# EAGLE schematic taillights3 (EAGLE 8.3.2)
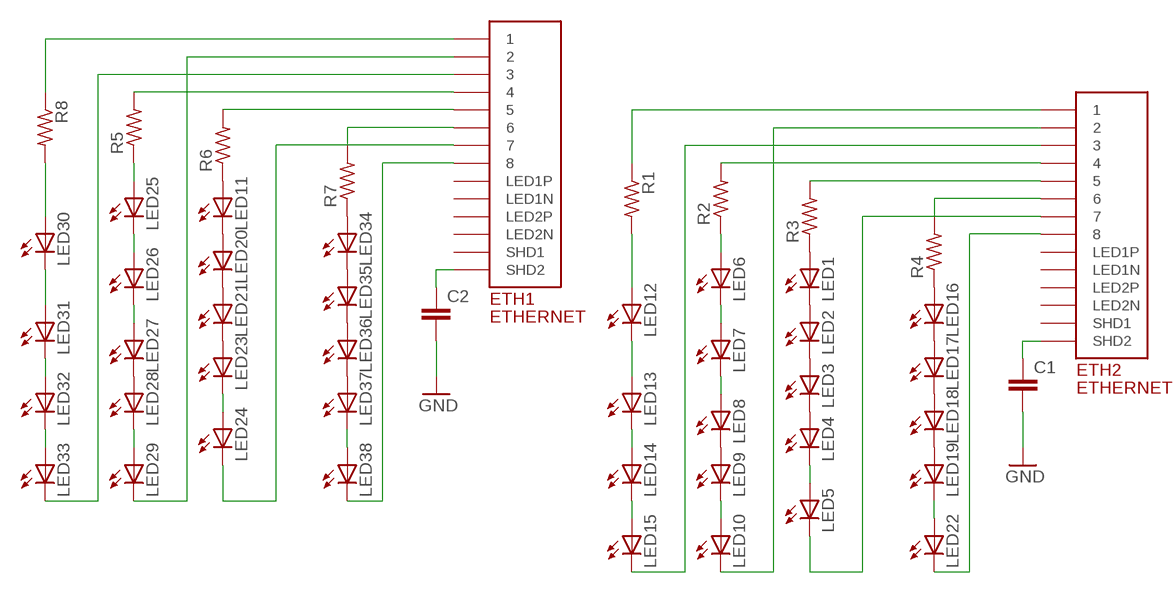
[diagram p0: schematic, sheet 1]

## Parts
C1  C2,5-3  [C2.5-3]
C2  C2,5-3  [C2.5-3]
ETH1  ETHERNET  [A122645-ND]
ETH2  ETHERNET  [A122645-ND]
LED1  LED  [SMARTLED-TTW]
LED2  LED  [SMARTLED-TTW]
LED3  LED  [SMARTLED-TTW]
LED4  LED  [SMARTLED-TTW]
LED5  LED  [SMARTLED-TTW]
LED6  LED  [SMARTLED-TTW]
LED7  LED  [SMARTLED-TTW]
LED8  LED  [SMARTLED-TTW]
LED9  LED  [SMARTLED-TTW]
LED10  LED  [SMARTLED-TTW]
LED11  LED  [SMARTLED-TTW]
LED12  LED  [SMARTLED-TTW]
LED13  LED  [SMARTLED-TTW]
LED14  LED  [SMARTLED-TTW]
LED15  LED  [SMARTLED-TTW]
LED16  LED  [SMARTLED-TTW]
LED17  LED  [SMARTLED-TTW]
LED18  LED  [SMARTLED-TTW]
LED19  LED  [SMARTLED-TTW]
LED20  LED  [SMARTLED-TTW]
LED21  LED  [SMARTLED-TTW]
LED22  LED  [SMARTLED-TTW]
LED23  LED  [SMARTLED-TTW]
LED24  LED  [SMARTLED-TTW]
LED25  LED  [SMARTLED-TTW]
LED26  LED  [SMARTLED-TTW]
LED27  LED  [SMARTLED-TTW]
LED28  LED  [SMARTLED-TTW]
LED29  LED  [SMARTLED-TTW]
LED30  LED  [SMARTLED-TTW]
LED31  LED  [SMARTLED-TTW]
LED32  LED  [SMARTLED-TTW]
LED33  LED  [SMARTLED-TTW]
LED34  LED  [SMARTLED-TTW]
LED35  LED  [SMARTLED-TTW]
LED36  LED  [SMARTLED-TTW]
LED37  LED  [SMARTLED-TTW]
LED38  LED  [SMARTLED-TTW]
R1  R-US_0204/5  [0204/5]
R2  R-US_0204/2V  [0204V]
R3  R-US_0204/2V  [0204V]
R4  R-US_0204/2V  [0204V]
R5  R-US_0204/2V  [0204V]
R6  R-US_0204/2V  [0204V]
R7  R-US_0204/2V  [0204V]
R8  R-US_0204/5  [0204/5]

## Nets
GND: C1.2 C2.2
N$1: LED1.A@1(A) R3.1
N$2: LED6.A@1(A) R2.1
N$3: LED12.A@1(A) R1.2
N$4: LED1.C@1(C) LED2.A@1(A)
N$5: LED2.C@1(C) LED3.A@1(A)
N$6: LED3.C@1(C) LED4.A@1(A)
N$7: LED4.C@1(C) LED5.A@1(A)
N$8: LED6.C@1(C) LED7.A@1(A)
N$9: LED7.C@1(C) LED8.A@1(A)
N$10: LED8.C@1(C) LED9.A@1(A)
N$11: LED9.C@1(C) LED10.A@1(A)
N$12: ETH2.P$2 LED10.C@1(C)
N$13: LED12.C@1(C) LED13.A@1(A)
N$14: LED13.C@1(C) LED14.A@1(A)
N$15: LED14.C@1(C) LED15.A@1(A)
N$16: LED16.C@1(C) LED17.A@1(A)
N$17: LED17.C@1(C) LED18.A@1(A)
N$18: LED18.C@1(C) LED19.A@1(A)
N$19: LED16.A@1(A) R4.1
N$20: C1.1 ETH2.P$14(SHD2)
N$21: ETH2.P$5 R3.2
N$22: ETH2.P$6 R4.2
N$23: LED19.C@1(C) LED22.A@1(A)
N$24: ETH2.P$4 R2.2
N$25: ETH2.P$3 LED15.C@1(C)
N$26: ETH2.P$1 R1.1
N$27: ETH2.P$7 LED5.C@1(C)
N$28: ETH2.P$8 LED22.C@1(C)
N$29: LED11.C@1(C) LED20.A@1(A)
N$30: LED20.C@1(C) LED21.A@1(A)
N$31: LED21.C@1(C) LED23.A@1(A)
N$32: LED23.C@1(C) LED24.A@1(A)
N$33: LED25.C@1(C) LED26.A@1(A)
N$34: LED26.C@1(C) LED27.A@1(A)
N$35: LED27.C@1(C) LED28.A@1(A)
N$36: LED28.C@1(C) LED29.A@1(A)
N$37: LED30.C@1(C) LED31.A@1(A)
N$38: LED31.C@1(C) LED32.A@1(A)
N$39: LED32.C@1(C) LED33.A@1(A)
N$40: LED34.C@1(C) LED35.A@1(A)
N$41: LED35.C@1(C) LED36.A@1(A)
N$42: LED36.C@1(C) LED37.A@1(A)
N$43: LED30.A@1(A) R8.2
N$44: LED34.A@1(A) R7.1
N$45: C2.1 ETH1.P$14(SHD2)
N$46: LED11.A@1(A) R6.1
N$47: LED25.A@1(A) R5.1
N$48: LED37.C@1(C) LED38.A@1(A)
N$49: ETH1.P$5 R6.2
N$50: ETH1.P$6 R7.2
N$51: ETH1.P$4 R5.2
N$52: ETH1.P$3 LED33.C@1(C)
N$53: ETH1.P$2 LED29.C@1(C)
N$54: ETH1.P$1 R8.1
N$55: ETH1.P$7 LED24.C@1(C)
N$56: ETH1.P$8 LED38.C@1(C)
Unconnected: ETH1.P$9(LED1N) ETH1.P$10(LED1P) ETH1.P$11(LED2N) ETH1.P$12(LED2P) ETH1.P$13(SHD1) ETH2.P$9(LED1N) ETH2.P$10(LED1P) ETH2.P$11(LED2N) ETH2.P$12(LED2P) ETH2.P$13(SHD1)

## Library data of the parts
C1 C2 = capacitor-wima:C: CAPACITOR naming: grid - package width
ETH1 ETH2 = ETHERNET:ETHERNET: Ethernet port with 2 leds. digikey number A122645-ND
LED1-LED38 = E-P-008-R1.2:LED: LED OSRAM: - CHIPLED LG R971, LG N971, LY N971, LG Q971, LY Q971, LO R971, LY R971 LH N974, LH R974 LS Q976, LO Q976, LY Q976 LO Q996 - Hyper CHIPLED LW Q18S LB Q993, LB Q99A, LB R99A - SideLED LS A670, LO A670, LY A670, LG A670, LP A670 LB A673, LV A673, LT A673, LW A673 LH A674 LY A675 LS A676, LA A676, LO A676, LY A676, LW A676 LS A679, LY A679, LG A679 - Hyper Micro SIDELED® LS Y876, LA Y876, LO Y876, LY Y876 LT Y87S - SmartLED LW L88C, LW L88S LB L89C, LB L89S, LG L890 LS L89K, LO L89K, LY L89K LS L896, LA L896, LO L896, LY L896 - TOPLED LS T670, LO T670, LY T670, LG T670, LP T670 LSG T670, LSP T670, LSY T670, LOP T670, LYG T670 LG T671, LOG T671, LSG T671 LB T673, LV T673, LT T673, LW T673 LH T674 LS T676, LA T676, LO T676, LY T676, LB T676, LH T676, LSB T676, LW T676 LB T67C, LV T67C, LT T67C, LS T67K, LO T67K, LY T67K, LW E67C LS E67B, LA E67B, LO E67B, LY E67B, LB E67C, LV E67C, LT E67C LW T67C LS T679, LY T679, LG T679 LS T770, LO T770, LY T770, LG T770, LP T770 LB T773, LV T773, LT T773, LW T773 LH T774 LS E675, LA E675, LY E675, LS T675 LS T776, LA T776, LO T776, LY T776, LB T776 LHGB T686 LT T68C, LB T68C - Hyper Mini TOPLED® LB M676 - Mini TOPLED Santana® LG M470 LS M47K, LO M47K, LY M47K Source: http://www.osram.convergy.de LUXEON: - LUMILED® LXK2-PW12-R00, LXK2-PW12-S00, LXK2-PW14-U00, LXK2-PW14-V00 LXK2-PM12-R00, LXK2-PM12-S00, LXK2-PM14-U00 LXK2-PE12-Q00, LXK2-PE12-R00, LXK2-PE12-S00, LXK2-PE14-T00, LXK2-PE14-U00 LXK2-PB12-K00, LXK2-PB12-L00, LXK2-PB12-M00, LXK2-PB14-N00, LXK2-PB14-P00, LXK2-PB14-Q00 LXK2-PR12-L00, LXK2-PR12-M00, LXK2-PR14-Q00, LXK2-PR14-R00 LXK2-PD12-Q00, LXK2-PD12-R00, LXK2-PD12-S00 LXK2-PH12-R00, LXK2-PH12-S00 LXK2-PL12-P00, LXK2-PL12-Q00, LXK2-PL12-R00 Source: www.luxeon.com KINGBRIGHT: KA-3528ASYC Source: www.kingbright.com
R1-R8 = resistor:R-US_: RESISTOR, American symbol